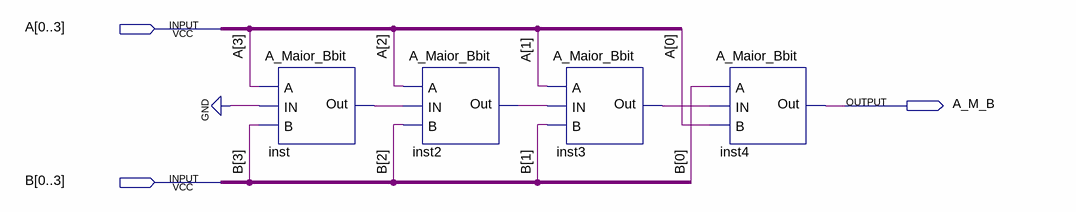
[diagram p0: schematic sheet]
// Quartus schematic A_Maior_B.bdf as structural Verilog: 4 symbols, 3 pins
module A_Maior_B (
  input  [0:3] A,
  input  [0:3] B,
  output A_M_B
);

  wire inst2_out, inst3_out, inst_out;

  A_Maior_Bbit inst (.A(A[3]), .IN(1'b0), .B(B[3]), .Out(inst_out));
  A_Maior_Bbit inst2 (.A(A[2]), .IN(inst_out), .B(B[2]), .Out(inst2_out));
  A_Maior_Bbit inst3 (.A(A[1]), .IN(inst2_out), .B(B[1]), .Out(inst3_out));
  A_Maior_Bbit inst4 (.A(B[0]), .IN(inst3_out), .B(A[0]), .Out(A_M_B));
endmodule
